# EAGLE design md-01 (EAGLE 9.6.2)
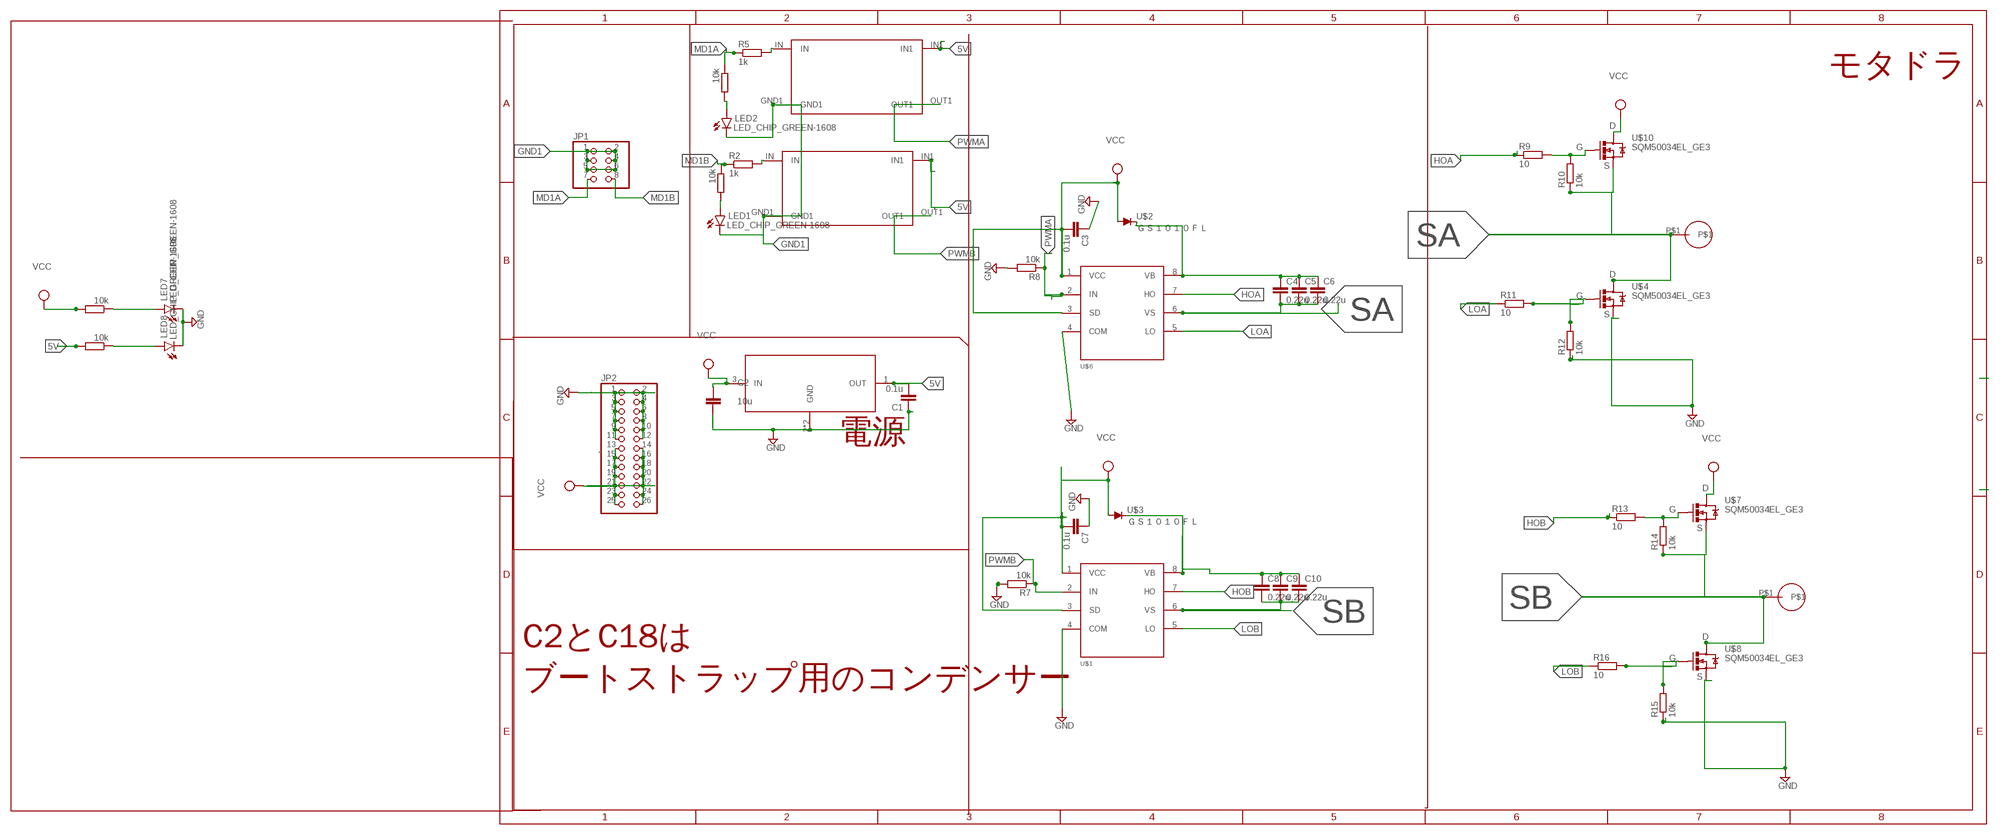
[diagram p0: schematic, sheet 1]

## Parts
C1  0.1u  C-EUC0603  [C0603]
C2  10u  C-EUC0805  [C0805]
C3  0.1u  C-EUC0603  [C0603]
C4  0.22u  C-EUC2012  [C2012]
C5  0.22u  C-EUC2012  [C2012]
C6  0.22u  C-EUC2012  [C2012]
C7  0.1u  C-EUC0603  [C0603]
C8  0.22u  C-EUC2012  [C2012]
C9  0.22u  C-EUC2012  [C2012]
C10  0.22u  C-EUC2012  [C2012]
JP1  PINHD-2X4/90  [2X04/90]
JP2  PINHD-2X13/90  [2X13/90]
LED1  LED_CHIP_GREEN-1608  [LEDC1608X39N_G]
LED2  LED_CHIP_GREEN-1608  [LEDC1608X39N_G]
LED7  LED_CHIP_GREEN-1608  [LEDC1608X39N_G]
LED8  LED_CHIP_GREEN-1608  [LEDC1608X39N_G]
R1  10k  R-EU_R0603  [R0603]
R2  1k  R-EU_R0603  [R0603]
R4  10k  R-EU_R0603  [R0603]
R5  1k  R-EU_R0603  [R0603]
R7  10k  R-EU_R0603  [R0603]
R8  10k  R-EU_R0603  [R0603]
R9  10  R-EU_R0603  [R0603]
R10  10k  R-EU_R0603  [R0603]
R11  10  R-EU_R0603  [R0603]
R12  10k  R-EU_R0603  [R0603]
R13  10  R-EU_R0603  [R0603]
R14  10k  R-EU_R0603  [R0603]
R15  10k  R-EU_R0603  [R0603]
R16  10  R-EU_R0603  [R0603]
R17  10k  R-EU_R0603  [R0603]
R19  10k  R-EU_R0603  [R0603]
U$1  ＩＲ２１０４ＳＴＲＰＢＦ  [SOIC-8]
U$2  ＧＳ１０１０ＦＬ  [DIODE_SOD-123FL]
U$3  ＧＳ１０１０ＦＬ  [DIODE_SOD-123FL]
U$4  SQM50034EL_GE3  [TO-263/D2PAK]
U$5  PV-3  [PV-3]
U$6  ＩＲ２１０４ＳＴＲＰＢＦ  [SOIC-8]
U$7  SQM50034EL_GE3  [TO-263/D2PAK]
U$8  SQM50034EL_GE3  [TO-263/D2PAK]
U$9  PV-3  [PV-3]
U$10  SQM50034EL_GE3  [TO-263/D2PAK]
U$11  ＴＬＰ２９３（ＧＢ）  [MINI-FLAT-4]
U$12  ＴＬＰ２９３（ＧＢ）  [MINI-FLAT-4]
U$13  NJM78L05SU3  [SOT-89]

## Nets
5V: C1.2 R19.2 U$11.IN1 U$12.IN1 U$13.1(OUT)
GND: C1.1 C2.2 C3.1 C7.1 JP2.1 JP2.2 JP2.3 JP2.4 JP2.5 JP2.6 JP2.7 JP2.8 JP2.9 JP2.10 JP2.11 JP2.12 LED7.1(C) LED8.1(C) R7.2 R8.2 R12.1 R15.1 U$1.4(COM) U$4.S U$6.4(COM) U$8.S U$13.2(GND) U$13.4(GND)
GND1: JP1.1 JP1.2 JP1.3 JP1.4 JP1.5 JP1.6 LED1.1(C) LED2.1(C) U$11.GND1 U$12.GND1
HOA: R9.1 U$6.7(HO)
HOB: R13.1 U$1.7(HO)
LOA: R11.1 U$6.5(LO)
LOB: R16.1 U$1.5(LO)
MD1A: JP1.7 R4.1 R5.1
MD1B: JP1.8 R1.1 R2.1
N$1: R15.2 R16.2 U$8.G
N$2: R11.2 R12.2 U$4.G
N$3: LED1.2(A) R1.2
N$4: R5.2 U$11.IN
N$5: R2.2 U$12.IN
N$7: LED2.2(A) R4.2
N$9: R13.2 R14.2 U$7.G
N$12: C8.1 C9.1 C10.1 U$1.8(VB) U$3.C
N$13: R9.2 R10.2 U$10.G
N$15: LED7.2(A) R17.1
N$18: LED8.2(A) R19.1
N$23: C4.1 C5.1 C6.1 U$2.C U$6.8(VB)
PWMA: R8.1 U$6.2(IN) U$11.OUT1
PWMB: R7.1 U$1.2(IN) U$12.OUT1
SA: C4.2 C5.2 C6.2 R10.1 U$4.D U$6.6(VS) U$9.P$1 U$10.S
SB: C8.2 C9.2 C10.2 R14.1 U$1.6(VS) U$5.P$1 U$7.S U$8.D
VCC: C2.1 C3.2 C7.2 JP2.13 JP2.14 JP2.15 JP2.16 JP2.17 JP2.18 JP2.19 JP2.20 JP2.21 JP2.22 JP2.23 JP2.24 JP2.25 JP2.26 R17.2 U$1.1(VCC) U$1.3(SD) U$2.A U$3.A U$6.1(VCC) U$6.3(SD) U$7.D U$10.D U$13.3(IN)

## Notes on the sheet
- モタドラ
- 電源
- C2とC18は
- ブートストラップ用のコンデンサー

## Library data of the parts
C1-C10 = rcl:C-EU: CAPACITOR, European symbol; SPICEPREFIX: C
JP1 = pinhead:PINHD-2X4: PIN HEADER
JP2 = pinhead:PINHD-2X13: PIN HEADER
LED1 LED2 LED7 LED8 = Tutorial - Fusion 360:LED_CHIP: LED - Generic; CATEGORY: Opto-Electronic; COLOR: Green; SUB-CATEGORY: LED
R1 R2 R4 R5 R7-R17 R19 = rcl:R-EU_: RESISTOR, European symbol; SPICEPREFIX: R
U$1 U$6 = ＩＲ２１０４ＳＴＲＰＢＦ:ＩＲ２１０４ＳＴＲＰＢＦ
U$2 U$3 = ＧＳ１０１０ＦＬ:ＧＳ１０１０ＦＬ
U$4 U$7 U$8 U$10 = SQM50034EL_GE3:SQM50034EL_GE3
U$5 U$9 = MD-Parts(ururu_senpai):PV-3
U$11 U$12 = ＴＬＰ２９３（ＧＢ）:ＴＬＰ２９３（ＧＢ）
U$13 = NJM78L05SU3:NJM78L05SU3

## Board
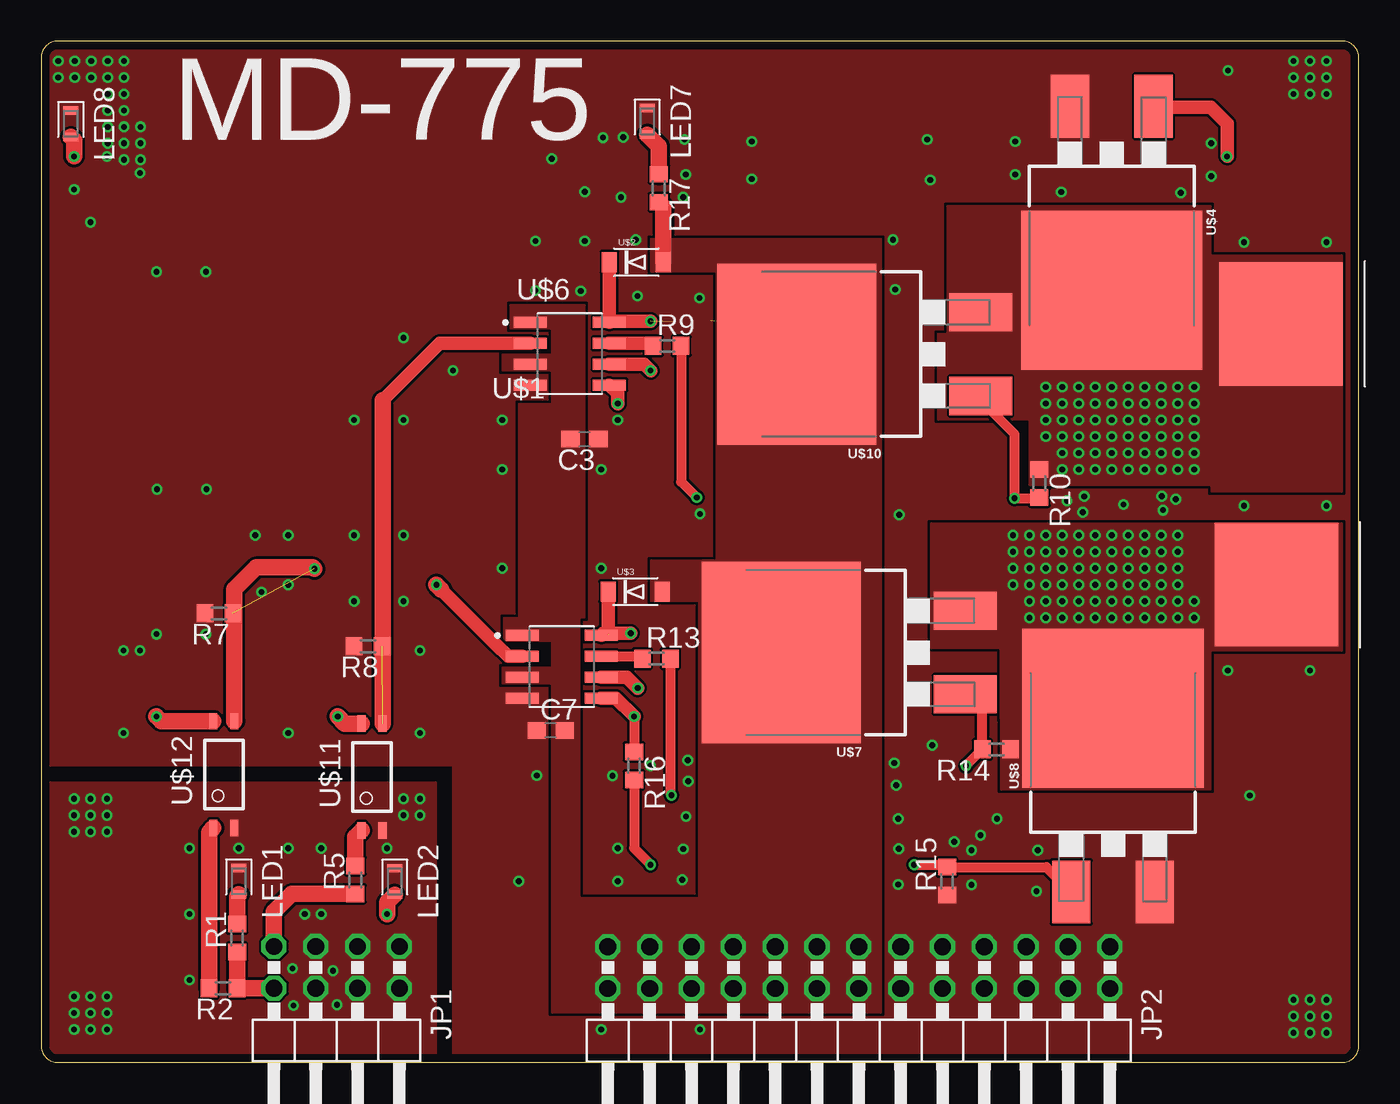
[diagram p1: board, top side]
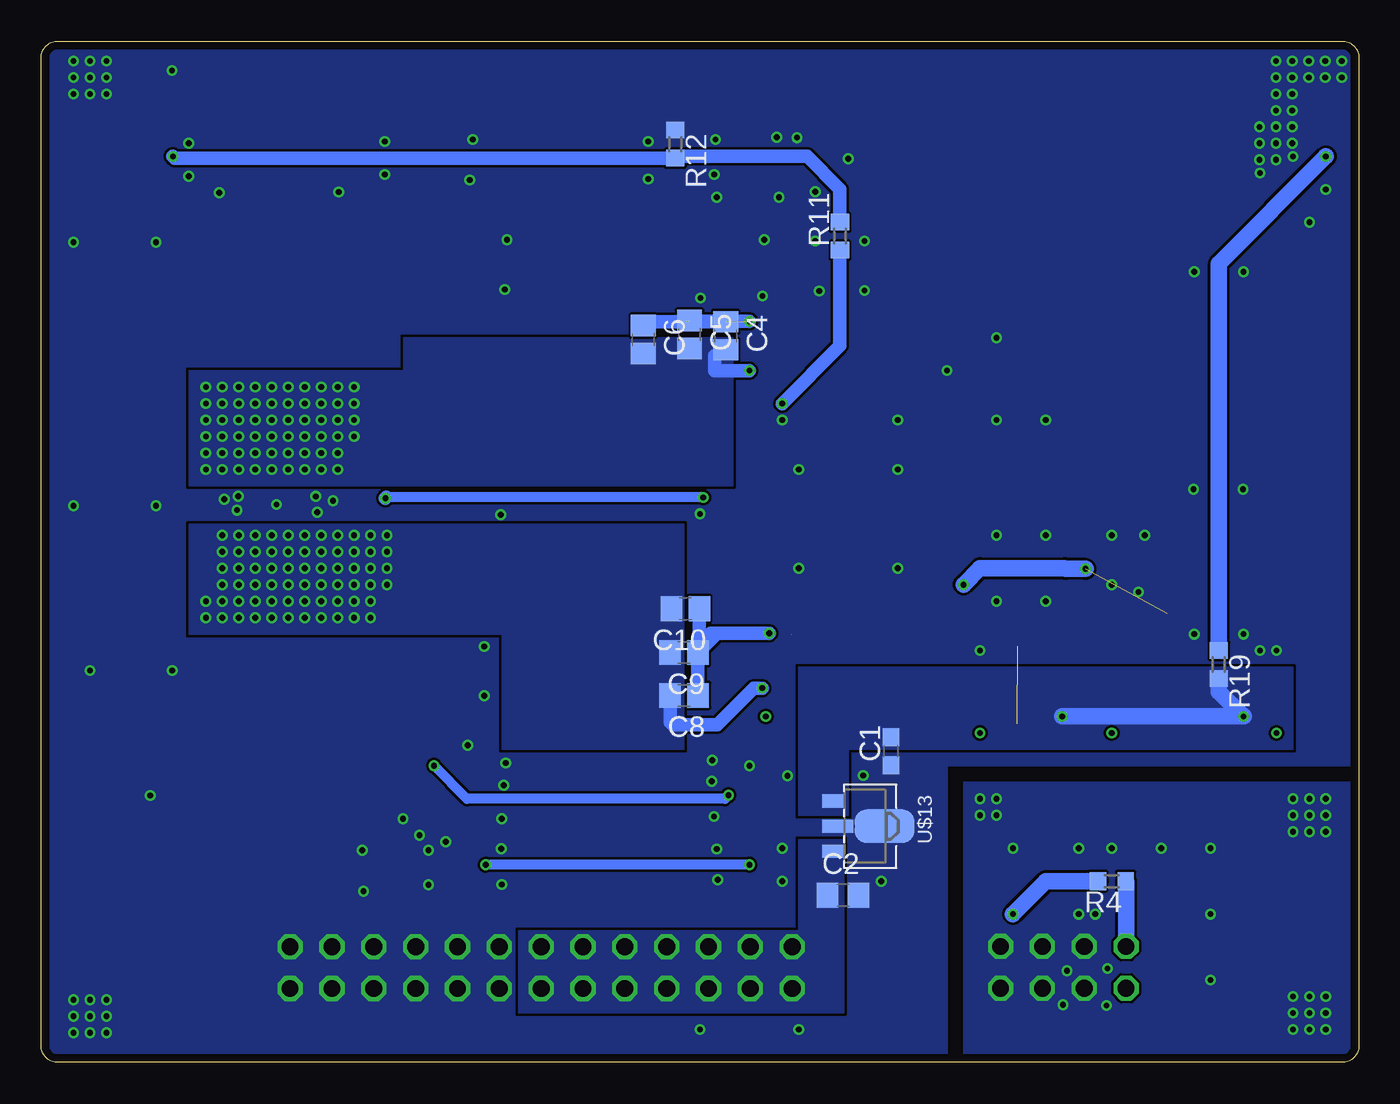
[diagram p2: board, bottom side, seen from below]

Size 80 x 62 mm. Coordinates in mm from the lower left corner, seen from the top.
Outline: 1,0 79,0 arc90 80,1 80,61 arc90 79,62 1,62 arc90 0,61 0,1 arc90 1,0
Copper layers (1*16): Top 0.035mm / dielectric 1.6mm / Bottom 0.035mm
Design rules "Elecrow_2-layer_PCB_eagle_rule": minimum track width 6mil, minimum drill 12mil, track to track 6mil, track to pad 6mil, pad to pad 6mil, via to via 8mil, smd to smd 0mil, copper to edge 20mil, drill to drill 10mil, minimum pad ring 6mil, minimum via ring 6mil, stop-mask expansion 0mil, vias tented up to drill 100mil, thermal gap 10mil

### Footprints (pad centres in the part's own frame; a part is rotated, then mirrored left to right if it is on the bottom)
C0603 = smd 1.1 x 1: 1 -0.85,0; 2 0.85,0
C0805 = smd 1.3 x 1.5: 1 -0.95,0; 2 0.95,0
C2012 = smd 1.3 x 1.5: 1 -0.85,0; 2 0.85,0
2X04/90 = drill 1.016 octagon: 1 -3.81,-6.35; 2 -3.81,-3.81; 3 -1.27,-6.35; 4 -1.27,-3.81; 5 1.27,-6.35; 6 1.27,-3.81; 7 3.81,-6.35; 8 3.81,-3.81
2X13/90 = drill 1.016 octagon: 1 -15.24,-6.35; 2 -15.24,-3.81; 3 -12.7,-6.35; 4 -12.7,-3.81; 5 -10.16,-6.35; 6 -10.16,-3.81; 7 -7.62,-6.35; 8 -7.62,-3.81; 9 -5.08,-6.35; 10 -5.08,-3.81; 11 -2.54,-6.35; 12 -2.54,-3.81; 13 0,-6.35; 14 0,-3.81; 15 2.54,-6.35; 16 2.54,-3.81; 17 5.08,-6.35; 18 5.08,-3.81; 19 7.62,-6.35; 20 7.62,-3.81; 21 10.16,-6.35; 22 10.16,-3.81; 23 12.7,-6.35; 24 12.7,-3.81; 25 15.24,-6.35; 26 15.24,-3.81
LEDC1608X39N_G = smd 0.512 x 0.912: 1 -0.8,0; 2 0.8,0
R0603 = smd 1 x 1.1: 1 -0.85,0; 2 0.85,0
SOIC-8 = smd 2 x 0.66: 1 -2.405,1.905; 2 -2.405,0.635; 3 -2.405,-0.635; 4 -2.405,-1.905; 5 2.405,-1.905; 6 2.405,-0.635; 7 2.405,0.635; 8 2.405,1.905
DIODE_SOD-123FL = smd 0.91 x 1.22: A 1.637,0; C -1.637,0
TO-263/D2PAK = smd 11 x 9.65: D 0,4.125 | smd 2.32 x 3.81: G -2.54,-7.045; S 2.54,-7.045
PV-3 = smd 7.5 x 7.5: P$1 0,0
MINI-FLAT-4 = smd 1 x 0.5: GND1 -3.24,-0.635; IN -3.24,0.635; IN1 3.24,0.635; OUT1 3.24,-0.635
SOT-89 = smd 0.8 x 1.4: 1 -1.524,-1.905; 3 1.524,-1.905 | smd 0.8 x 1.9: 2 0,-1.651 | smd 2.032 x 3.65: 4 0,1.194

### Placement (x,y rotation side)
C1  28.41,18.89 90 bottom
C2  31.32,10.15 0 bottom
C3  32.99,37.85 180 top
C4  38.43,44.11 270 bottom
C5  40.64,44.19 270 bottom
C6  43.45,43.88 270 bottom
C7  30.93,20.15 0 top
C8  40.96,22.28 180 bottom
C9  40.98,24.88 180 bottom
C10  40.88,27.55 180 bottom
JP1  17.94,0.69 180 top
JP2  49.65,0.67 180 top
LED1  12,11 270 top
LED2  21.46,10.98 270 top
LED7  36.8,57.13 270 top
LED8  1.8,56.99 270 top
R1  11.89,7.54 90 top
R2  11.04,4.5 180 top
R4  15,11 180 bottom
R5  19.07,11.08 90 top
R7  10.8,27.26 180 top
R8  19.84,25.27 180 top
R9  38.01,43.5 0 top
R10  60.6,35.15 270 top
R11  31.5,50.17 90 bottom
R12  41.5,55.75 270 bottom
R13  37.35,24.51 0 top
R14  58,19 180 top
R15  55,11 90 top
R16  36,18 270 top
R17  37.5,53.07 270 top
R19  8.5,24.15 270 bottom
U$1  31.6,24.02 0 top
U$2  36.14,48.58 0 top
U$3  36.06,28.58 0 top
U$4  65,51 180 top
U$5  75,29 180 top
U$6  32.09,43.02 0 top
U$7  49.06,24.88 90 top
U$8  65.08,17.39 0 top
U$9  75.29,44.83 180 top
U$10  50,43 90 top
U$11  20.09,17.32 90 top
U$12  11.09,17.47 90 top
U$13  29.98,14.34 270 bottom

### Tracks (layer width: path | path; a pad name or v marks a point on that pad's centre or on a via)
5V  (via drill 0.35)
  Top 1.016: U$12.IN1 7.29,20.71 v7,21 | U$11.IN1 18.44,20.56 v18,21
  Bottom 1.016: R19.2 8.5,22.5 v7,21 v18,21
  pour Bottom (no thermals): 31,15 31,19 4,19 4,24 34,24 34,15
GND  (via drill 0.35)
  other vias: 28,39 35,39 34,30 28,30 37,18 35,13 35,11 29,11 30.09,17.41 34.69,17.4 38.99,52.52 39.05,56.03 35.35,56.17 35.2,52.52 36.2,46.52 32.77,46.83 33.01,49.87 36.1,49.94 33.01,52.87 30.01,49.87 30.01,46.87 73.03,33.8 78.03,33.8 78.03,49.8 73.03,49.8 72.03,23.8 77.03,23.8 34,36 28,36 15,20 15,29 23,25 23,20 6,25 5,20 5,25 19,28 22,28 19,32 22,32 22,39 19,39 22,44 25,42 10,48 10,26 7,26 7,48 2,53 4,55 6,54 3,51 58.03,14.8 52.03,14.8 52.03,10.8 57.03,13.8 71.03,53.8 71.03,55.8 72.06,60.22 78.03,2.8 78.03,3.8 78.03,1.8 77.03,1.8 76.03,1.8 76.03,2.8 76.03,3.8 77.03,3.8 77.03,2.8 77.03,60.8 78.03,60.8 78.03,59.8 77.03,59.8 77.03,58.8 78.03,58.8 76.03,58.8 76.03,59.8 76.03,60.8 4.03,57.8 4.03,56.8 4.03,55.8 40,33.3 52.1,33.25 62.28,34.1 61.93,52.85 69.18,52.8 68.88,34.2 73.38,16.2 55.43,13.4 63.24,33.39 68.11,33.53 65.72,33.87 63.33,34.36 68.03,34.38 53.1,25.25 53.1,22.25 54.1,19.25 40,2 34,2 10.03,34.8 7.03,34.8 39.25,18.34 39.29,17.06 39.15,14.92 51.92,16.82 51.8,18.18 52.07,12.98 38.99,12.96 38.93,11.09 39.13,53.91 59.13,53.91 59.13,55.91 31.01,54.87 34.11,56.15 43.13,55.91 60.43,10.4 60.51,12.87 56.49,12.88 56.48,10.78 43.13,53.63 53.97,53.57 53.79,56.03 39.97,46.41 51.86,46.92 51.71,49.94 4.03,58.8 4.03,59.8 2.03,59.8 3.03,59.8 1.03,59.8 1.03,60.8 2.03,60.8 3.03,60.8 4.03,60.8 5.03,60.8 5.03,59.8 5.03,58.8 5.03,57.8 5.03,56.8 5.03,55.8 5.03,54.8 6.03,54.8 6.03,55.8 6.03,56.8 15,32 13,32 13.37,28.55
  pour Top (rank 2, no thermals): 79,0 arc90 81,2 81,62 0,62 0,18 25,18 25,0
  pour Bottom (rank 2, no thermals): 25,0 25,18 0,18 0,62 81,62 81,0
GND1  (via drill 0.35)
  other vias: 15,13 16,9 17,9 17,13 21,13 12,13 9,13 9,9 9,5 15.26,5.69 17.72,5.56 17.96,3.49 15.32,3.45 2,2 2,3 3,3 3,4 4,4 4,3 3,2 2,16 3,16 2,15 3,15 4,15 4,14 3,14 23,16 23,15 22,15 22,16 4,16 2,14 2,4 4,2
  pour Bottom (rank 2, no thermals): 24,0 24,17 0,17 0,0
  pour Top (rank 2, no thermals): 24,0 24,17 0,17 0,0 2,0
HOA
  Top 0.813: U$6.7 37.01,43.66 R9.1
HOB
  Top 0.61: U$1.7 36.56,24.66 36.56,24.57 R13.1
LOA  (via drill 0.35)
  Top 0.813: U$6.5 35,40.61 v35,40
  Bottom 0.813: v35,40 31.5,43.5 R11.1
LOB  (via drill 0.35)
  Top 0.61: v36,21 R16.1
  Top 0.813: v36,21 34.88,22.11 U$1.5
MD1A
  Top 1.016: JP1.7 14.13,9.13 15.23,10.23 R5.1
  Bottom 1.016: JP1.7 14.13,10.98 R4.1
MD1B
  Top 1.016: JP1.8 R2.1 R1.1
N$1  (via drill 0.35)
  Top 0.61: v37,12 36,13 R16.2 | v53,12 54.85,12 R15.2 61.03,11.85 U$8.G
  Bottom 0.61: v37,12 v53,12
N$2  (via drill 0.35)
  Top 0.152: U$4.G 67.95,58.05 68,58
  Top 0.813: v72,55 72,57 71,58 68,58 67.75,58
  Bottom 0.813: R11.2 31.5,53.02 33.5,55.02 41.38,55.02 R12.2 71.9,54.9 v72,55
N$3
  Top 1.016: R1.2 11.89,10.09 LED1.2
N$4
  Top 1.016: R5.2 19.07,13.7 U$11.IN
N$5
  Top 1.016: R2.2 10.19,13.96 U$12.IN
N$7  (via drill 0.35)
  Top 1.016: v21,9 21,9.72 LED2.2
  Bottom 1.016: R4.2 19,11 v21,9
N$9  (via drill 0.35)
  Top 0.61: R13.2 38.2,16.29 v38.27,16.22 | U$7.G 57.11,21.34 57.11,19.04 R14.2 v56.15,18
  Bottom 0.61: v38.27,16.22 38.49,16 54.15,16 v56.15,18
N$12  (via drill 0.35)  (1 unrouted)
  Top 0.813: U$3.C 34.42,25.99 | 34.42,26 34.08,26 U$1.8 34.13,26.05 v35.8,26.05
  Bottom 0.61: 35.88,25.97 v35.8,26.05
  Bottom 0.813: 39.34,26.05 38.96,26.05 | v35.8,26.05 38,26.05 38.96,26.05 | C10.1 40.03,24.98 C9.1 | C9.1 40.13,22.3 C8.1 | C9.1 38.96,26.05
N$13  (via drill 0.35)
  Top 0.61: R9.2 38.86,35.24 v39.8,34.3 | 60.54,34.25 v59.1,34.25 59.1,38.13 56.92,40.31 57.05,40.43 U$10.G
  Top 0.813: 60.54,34.25 R10.2
  Bottom 0.61: v39.8,34.3 59.05,34.3
  Bottom 0.813: 59.05,34.3 v59.1,34.25
N$15
  Top 1.016: LED7.2 37.5,55.63 R17.1
N$18  (via drill 0.35)
  Top 1.016: v2,55 2,55.99 LED8.2
  Bottom 1.016: R19.1 8.5,48.5 v2,55
N$23  (via drill 0.35)  (2 unrouted)
  Top 0.813: v37,45 34.57,45 | 34.57,45 U$6.8 | U$2.C 34.5,45 34.57,45
  Bottom 0.813: v37.01,44.99 v37,45 40.87,45 | C4.1 43.22,44.96 C6.1
PWMA  (1 unrouted)
  Top 0.813: 20.73,40.2 24.18,43.66 U$6.2
  Top 1.016: U$11.OUT1 20.73,40.2
PWMB  (via drill 0.35)  (1 unrouted)
  Top 0.813: v24,29 27.64,25.36 | 27.64,25.36 | 27.64,25.36 28.34,24.66 U$1.2
  Top 1.016: U$12.OUT1 11.72,28.73 13.05,30.05 16.5,30.05 v16.59,29.96 | v24,29 24.3,28.7
  Bottom 1.016: v16.59,29.96 17.82,29.96 17.85,30 23,30 v24,29
SA  (via drill 0.35)
  Top 0.813: U$6.6 36.62,42.38 v37,42
  Bottom 0.813: v37,42 39.11,42 39.11,42.91
  other vias: 61,41 61,40 61,39 61,38 62,41 62,40 62,39 62,38 63,38 62,37 62,36 63,36 63,37 63,39 63,40 63,41 64,41 64,40 64,39 64,38 64,37 64,36 65,36 65,37 65,38 65,39 65,40 65,41 66,41 66,40 66,39 66,38 66,37 66,36 67,36 67,37 67,38 67,39 67,40 67,41 68,41 68,40 68,39 68,38 68,37 68,36 69,36 69,37 69,38 69,39 69,40 69,41 70,41 70,40 70,39 70,38 70,37 70,36
  pour Top (no thermals): 54.44,44.23 54.44,39 60,39 60,35.05 71.05,35.05 71.05,34.66 79,34.66 79,49 71,49 71,52 55,52 55,44.25 54.42,44.25
  pour Bottom (no thermals): 38,44 38,35 71,35 71,42 58,42 58,44
SB  (via drill 0.35)
  Top 0.813: U$1.6 35.56,23.39 v36.22,22.72
  Bottom 0.813: v36.22,22.72 36.73,22.72 38.97,20.49 41.65,20.49 41.81,20.65 C8.2
  other vias: 59,32 59,31 59,30 59,29 70,28 70,27 60,27 61,27 62,27 63,27 64,27 65,27 66,27 67,27 68,27 69,27 69,28 69,29 69,30 69,31 69,32 68,32 68,31 68,30 68,29 68,28 67,28 67,29 67,30 67,31 67,32 60,32 61,32 63,32 62,32 64,32 65,32 66,32 66,31 65,31 64,31 63,31 62,31 61,31 60,31 60,30 61,30 62,30 63,30 64,30 65,30 66,30 66,29 66,28 65,28 65,29 64,29 64,28 63,28 63,29 62,29 62,28 61,28 61,29 60,29 60,28
  pour Bottom (no thermals): 40.97,32.68 40.97,19 52,19 52,26 71,26 71,32.68
  pour Top (no thermals): 58.25,16.54 71,16.54 71,25 79,25 79,32.73 54,32.73 54,25.14 58.24,25.14
VCC
  Top 1.016: R17.2 37.78,51.94 U$2.A
  pour Top (no thermals): 37,48 41,48 41,30.48 37,30.48 37,28 39.92,28 39.92,8 33,8 33,3 51,3 51,50 37,50
  pour Top (no thermals): 33,3 31,3 31,22 31,23 28,23 28,24 31,24 31,25.57 28.07,25.57 28.07,27 29,27 29,40 31,40 31,42 28,42 28,43 31,43 31,44.55 28.48,44.55 28.48,46 33,46 33,27 32.7,27 32.7,25.75 32.7,10 41,10 41,3
  pour Bottom (no thermals): 51,8 51,3 33,3 31.27,3 31.27,10.87 31.27,13.5 32.85,13.5 34,13.5 34,8

### Text on the board
tNames: MD-775